# Altium project LeVentilateur.PrjPcb (part 3 of 4)

## Sheet 03-Actuators.SchDoc
size A4
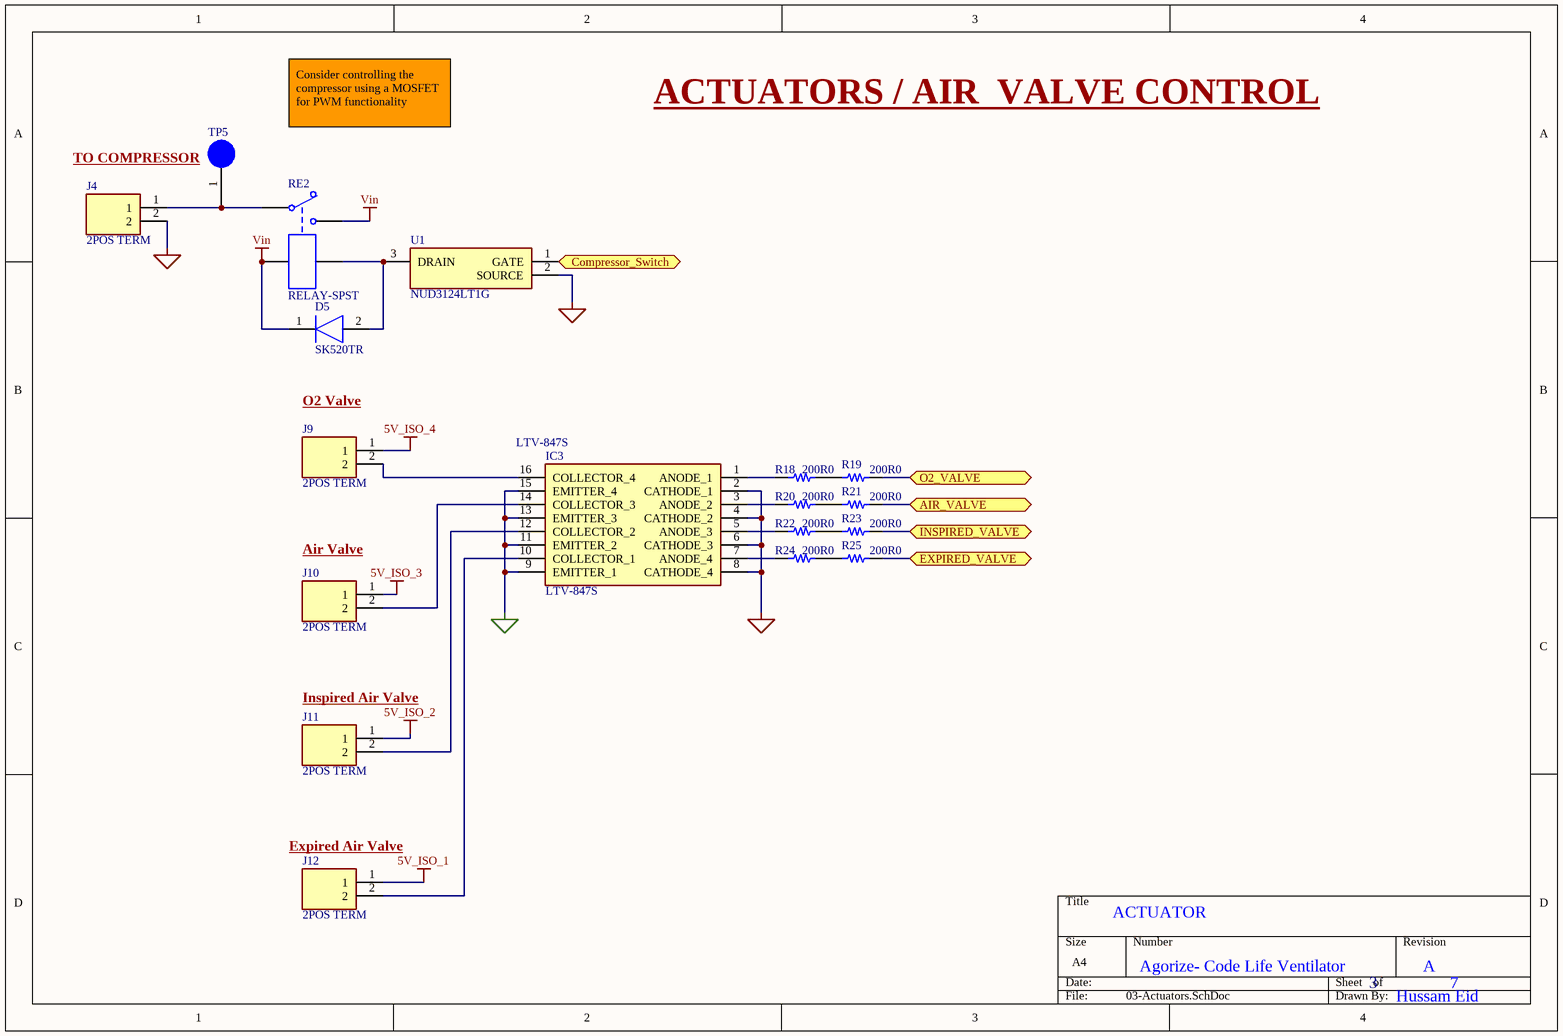
[diagram p2: 03-Actuators.SchDoc]

### Parts
D5  SK520TR  [DIOM8060X295N]
IC3  LTV-847S  [SOP254P1031X450-16N]
J4  2POS TERM  [SHDR2W110P0X500_1X2_1000X830X1140P]
J9  2POS TERM  [SHDR2W110P0X500_1X2_1000X830X1140P]
J10  2POS TERM  [SHDR2W110P0X500_1X2_1000X830X1140P]
J11  2POS TERM  [SHDR2W110P0X500_1X2_1000X830X1140P]
J12  2POS TERM  [SHDR2W110P0X500_1X2_1000X830X1140P]
R18  200R0  [RES 1206/3216]
R19  200R0  [RES 1206/3216]
R20  200R0  [RES 1206/3216]
R21  200R0  [RES 1206/3216]
R22  200R0  [RES 1206/3216]
R23  200R0  [RES 1206/3216]
R24  200R0  [RES 1206/3216]
R25  200R0  [RES 1206/3216]
RE2  RELAY-SPST  [JSM1A12V4]
TP5  TP  [TP]  (value not drawn)
U1  NUD3124LT1G  [SOT96P237X111-3N]

### Ports
AIR_VALVE (bidir), Compressor_Switch (bidir), EXPIRED_VALVE (bidir), INSPIRED_VALVE (bidir), O2_VALVE (bidir)

### Nets
5V_ISO_1: J12.1
5V_ISO_2: J11.1
5V_ISO_3: J10.1
5V_ISO_4: J9.1
COM: IC3.2(CATHODE_1) IC3.4(CATHODE_2) IC3.6(CATHODE_3) IC3.8(CATHODE_4) J4.2 U1.2(SOURCE)
COM_ISO: IC3.9(EMITTER_1) IC3.11(EMITTER_2) IC3.13(EMITTER_3) IC3.15(EMITTER_4)
Vin: D5.1(K) RE2.2 RE2.3
NetD5_2: D5.2(A) RE2.5 U1.3(DRAIN)
NetIC1_55: U1.1(GATE) ; port Compressor_Switch
NetIC1_56: R25.1 ; port EXPIRED_VALVE
NetIC1_57: R23.1 ; port INSPIRED_VALVE
NetIC1_58: R21.1 ; port AIR_VALVE
NetIC1_59: R19.1 ; port O2_VALVE
NetIC3_1: IC3.1(ANODE_1) R18.2
NetIC3_3: IC3.3(ANODE_2) R20.2
NetIC3_5: IC3.5(ANODE_3) R22.2
NetIC3_7: IC3.7(ANODE_4) R24.2
NetIC3_10: IC3.10(COLLECTOR_1) J12.2
NetIC3_12: IC3.12(COLLECTOR_2) J11.2
NetIC3_14: IC3.14(COLLECTOR_3) J10.2
NetIC3_16: IC3.16(COLLECTOR_4) J9.2
NetJ4_1: J4.1 RE2.1 TP5.1
NetR18_1: R18.1 R19.2
NetR20_1: R20.1 R21.2
NetR22_1: R22.1 R23.2
NetR24_1: R24.1 R25.2

### Notes on the sheet
- ACTUATORS / AIR  VALVE CONTROL
- TO COMPRESSOR
- Consider controlling the compressor using a MOSFET for PWM functionality
- O2 Valve
- (near J10) Air Valve
- (near J11) Inspired Air Valve
- (near J12) Expired Air Valve
- ACTUATOR
- Agorize- Code Life Ventilator
- 3
- A
- 7
- Hussam Eid

### Library data of the parts
D5 = SK520TR: DIODE SCHOTTKY 200V 5A SMC; Supplier 1: Digi-Key; Supplier Part Number 1: 1655-1603-1-ND; Manufacturer 1: SMC; Manufacturer Part Number 1: SK520TR; RoHS 1: No; Description 1: DIODE SCHOTTKY 200V 5A SMC; Stock 1: 19874; Pricing 1: 1 = 0.35000, 10 = 0.28500, 25 = 0.26040, 100 = 0.16360, 250 = 0.16176, 500 = 0.15148, 1000 = 0.10300 (USD); Mount: Surface Mount; Case/Package: SMC; Packaging: Tape and Reel; Max Reverse Voltage (DC): 200V; Average Rectified Current: 5A; ComponentLink1URL: http://www.smc-diodes.com/propdf/SK520%20N0107%20REV.A.pdf?src-supplier=Digi-Key; ComponentLink1Description: http://www.smc-diodes.com/propdf/SK520%20N0107%20REV.A.pdf?src-supplier=Digi-Key
IC3 = LTV-847S: OPTOISOLTR 5KV 4CH TRANS 16-SMD; Manufacturer 1: Vishay Lite-On; Forward Voltage: 1.4V; Rise Time: 18000ns; Number of Channels: 4; Collector Emitter Voltage (VCEO): 35V; Forward Current: 50mA; Collector Emitter Saturation Voltage: 200mV; Max Power Dissipation: 200mW; Current Transfer Ratio: 600%; Reverse Breakdown Voltage: 6V; Supplier 1: Digi-Key; Supplier Part Number 1: 160-1371-5-ND; Manufacturer Part Number 1: LTV-847S; RoHS 1: Yes; Description 1: OPTOISOLTR 5KV 4CH TRANS 16-SMD; Stock 1: 44348; Pricing 1: 1 = 1.02000, 10 = 0.82500, 100 = 0.50760, 500 = 0.43146, 1000 = 0.35532, 2500 = 0.33756, 5000 = 0.32994, 10000 = 0.32233, 25000 = 0.31725 (USD); Mount: Surface Mount; Case/Package: SMD/SMT; Number of Pins: 16; Min Operating Temperature: -30°C; Max Operating Temperature: 110°C; Packaging: Rail/Tube; Fall Time: 18000ns; Max Output Voltage: 35V; Output Current per Channel: 50mA; Max Input Current: 50mA; Isolation Voltage: 5kV; Max Collector Current: 50mA; Number of Elements: 4; Power Dissipation: 200mW; Package Quantity: 25; Number of Circuits: 4; Output Voltage: 35V; Radiation Hardening: No; Lead Free: Lead Free; ComponentLink1URL: https://datasheet.ciiva.com/11771/0900766b80de6da2-11771782.pdf?src-supplier=RSComponents; ComponentLink1Description: https://datasheet.ciiva.com/11771/0900766b80de6da2-11771782.pdf?src-supplier=RSComponents; ComponentLink2URL: https://datasheet.ciiva.com/15118/getdatasheetpartid-119507-15118694.pdf?src-supplier=Verical; ComponentLink2Description: https://datasheet.ciiva.com/15118/getdatasheetpartid-119507-15118694.pdf?src-supplier=Verical; ComponentLink3URL: https://datasheet.ciiva.com/2086/s-110-ltv-817827847m-s-s-ta-s-ta1-s-tpseries-2086410.pdf?src-supplier=Digi-Key; ComponentLink3Description: https://datasheet.ciiva.com/2086/s-110-ltv-817827847m-s-s-ta-s-ta1-s-tpseries-2086410.pdf?src-supplier=Digi-Key; ComponentLink4URL: https://datasheet.ciiva.com/16294/ltv-817-827-847-16294014.pdf?src-supplier=Future+Electronics; ComponentLink4Description: https://datasheet.ciiva.com/16294/ltv-817-827-847-16294014.pdf?src-supplier=Future+Electronics
J4 J9-J12 = 1935161: TERM BLK 2POS SIDE ENTRY 5MM PCB; Manufacturer 1: Phoenix Contact; Description 1: Conn Terminal Blocks 2 POS 5mm Solder ST Thru-Hole 16A; Connector Type: Screw; Voltage Rating (DC): 320V; Max Current Rating: 16A; Max Supply Voltage: 250V; Current Rating: 17.5A; Number of Poles: 2; Number of Levels: 1; Current: 18A; Voltage: 300V; Wire Gauge (Max): 26AWG; Wire Gauge (Min): 12AWG; Approvals: UL; ComponentLink1URL: https://datasheet.ciiva.com/15169/getdatasheetpartid-177903-15169663.pdf?src-supplier=Verical; ComponentLink1Description: https://datasheet.ciiva.com/15169/getdatasheetpartid-177903-15169663.pdf?src-supplier=Verical; ComponentLink2URL: https://datasheet.ciiva.com/16047/1935161-16047247.pdf?src-supplier=Onlinecomponents.com; ComponentLink2Description: https://datasheet.ciiva.com/16047/1935161-16047247.pdf?src-supplier=Onlinecomponents.com; ComponentLink3URL: https://datasheet.ciiva.com/824/combiconcompact5-0mmseries-824222.pdf?src-supplier=Digi-Key; ComponentLink3Description: https://datasheet.ciiva.com/824/combiconcompact5-0mmseries-824222.pdf?src-supplier=Digi-Key; Supplier 1: Digi-Key; Supplier Part Number 1: 277-1667-ND; Manufacturer Part Number 1: 1935161; RoHS 1: Yes; Stock 1: 32563; Pricing 1: 1 = 0.43000, 10 = 0.41100, 50 = 0.39280, 100 = 0.38200, 250 = 0.35700, 500 = 0.32844, 1000 = 0.30350 (USD); Mount: Through Hole; Number of Pins: 2; Weight: 0.067021oz; Contact Material: Copper,Tin; Insulation Material: Nylon; Housing Material: Polyamide; Housing Color: Green; Color: Green; Material: Nylon; Number of Rows: 1; Voltage Rating: 250V; Package Quantity: 250; Packaging: Bulk; Number of Positions: 2; Number of Positions Per Level: 2; Termination: Solder; Number of Contacts: 2; Number of Circuits: 2; Orientation: Straight; Length: 9mm; Height: 11.3mm; Width: 14.9mm; Pitch: 5mm; Depth: 9mm; Wire/Cable Gauge: 26AWG; Radiation Hardening: No; Flammability Rating: UL94 V-0; Lead Free: Lead Free; REACH SVHC: Unknown
R18-R25 = ERJ-8ENF1002V: RES SMD 10K OHM 1% 1/4W 1206; Manufacturer 1: Yageo; Manufacturer Part Number 1: RC1206FR-07200RL; Description 1: Res Thick Film 1206 200 Ohm 1% 0.25W(1/4W) ±100ppm/C Molded SMD Paper T/R; Temperature Coefficient: 100ppm/°C; Resistance: 200R; Voltage Rating (DC): 200V; Power Rating: 250mW; ComponentLink1Description: Datasheet; ComponentLink1URL: http://industrial.panasonic.com/www-cgi/jvcr13pz.cgi?E+PZ+3+AOA0002+ERJ8ENF1002V+7+WW; ComponentLink2Description: Digi-Key listing; ComponentLink2URL: http://digikey.com/product-detail/en/ERJ-8ENF1002V/P10.0KFTR-ND/89059; Supplier 1: Digi-Key; Supplier Part Number 1: 311-200FRCT-ND; RoHS 1: Yes; Stock 1: 2870115; Pricing 1: 1 = 0.10000, 10 = 0.07100, 100 = 0.02910, 1000 = 0.01306, 2500 = 0.01134 (USD); Mount: Surface Mount; Case/Package: 1206; Weight: 0.000571oz; Case Code (Metric): 3216; Case Code (Imperial): 1206; Min Operating Temperature: -55°C; Max Operating Temperature: 155°C; Composition: Thick Film; Tolerance: 1%; Packaging: Tape and Reel; Termination: SMD/SMT; Military Standard: Not; Voltage Rating: 200V; Length: 3.1mm; Height: 0.55mm; Width: 1.6mm; Depth: 1.6mm; Lead Free: Lead Free; ComponentLink3URL: https://datasheet.ciiva.com/11808/0900766b80c6630a-11808603.pdf?src-supplier=RSComponents; ComponentLink3Description: https://datasheet.ciiva.com/11808/0900766b80c6630a-11808603.pdf?src-supplier=RSComponents
RE2 = RELAY-SPST: RELAY AUTOMOTIVE SPST 15A 12V; Manufacturer 1: Panasonic; Manufacturer Part Number 1: JSM1A-12V-5; Max Voltage Rating (DC): 16V; Power Consumption: 640mW; Coil Current: 53.3mA; Operate Time: 10ms; Coil Resistance: 225R; Coil Type: Non-Latching; Supplier 1: Digi-Key; Supplier Part Number 1: 255-2815-ND; RoHS 1: Yes; Description 1: RELAY AUTOMOTIVE SPST 15A 12V; Stock 1: 2893; Pricing 1: 1 = 1.75000, 10 = 1.64300, 25 = 1.46000, 50 = 1.38700, 100 = 1.31400, 250 = 1.16800, 500 = 1.09500, 1000 = 1.02200, 5000 = 0.98550 (USD); Mount: Through Hole; Number of Pins: 4; Weight: 12g; Contact Material: Silver,Cadmium; Min Operating Temperature: -40°C; Max Operating Temperature: 85°C; Max Current Rating: 15A; Package Quantity: 100; Packaging: Bulk; Contact Current Rating: 15A; Throw Configuration: SPST; Release Time: 10ms; Termination: PC Pin; Coil Power: 640mW; Relay Type: Automotive; Coil Voltage (DC): 12V; Lead Free: Lead Free; ComponentLink1URL: https://datasheet.ciiva.com/2408/ds-61211-en-jsm-pd-2408039.pdf?src-supplier=Digi-Key; ComponentLink1Description: https://datasheet.ciiva.com/2408/ds-61211-en-jsm-pd-2408039.pdf?src-supplier=Digi-Key
TP5 = TP: Test Point
U1 = NUD3124LT1G: IC PWR DRVR N-CHAN 1:1 SOT23-3; Manufacturer 1: ON Semiconductor; Description 1: Trans MOSFET N-CH 28V 0.15A 3-Pin SOT-23 T/R; Output Configuration: Low Side; Rise Time: 708ns; Max Supply Voltage: 28V; Number of Outputs: 1; Max Output Current: 150mA; Gate to Source Voltage (Vgs): 12V; Power Dissipation: 225mW; Interface: On/Off; Output Current: 200mA; On-State Resistance: 1.4R; Element Configuration: Single; Drain to Source Resistance: 800mR; Supplier 1: Digi-Key; Supplier Part Number 1: NUD3124LT1GOSCT-ND; Manufacturer Part Number 1: NUD3124LT1G; RoHS 1: Yes; Stock 1: 48744; Pricing 1: 1 = 0.40000, 10 = 0.34200, 25 = 0.31880, 100 = 0.23690, 250 = 0.20044, 500 = 0.19132, 1000 = 0.14121 (USD); Mount: Surface Mount; Case/Package: SOT-23; Number of Pins: 3; Contact Plating: Tin,Matte; Min Operating Temperature: -40°C; Max Operating Temperature: 125°C; Packaging: Tape and Reel; Package Quantity: 3000; Continuous Drain Current (ID): 150mA; Number of Elements: 1; Number of Drivers: 1; Output Voltage: 28V; Current Rating: 200mA; Drain to Source Voltage (Vdss): 28V; Drain to Source Breakdown Voltage: 28V; Fall Time: 708ns; Length: 3.04mm; Height: 1.01mm; Width: 1.4mm; Radiation Hardening: No; Lead Free: Lead Free; Halogen Free: Halogen Free; REACH SVHC: No SVHC; ComponentLink1URL: https://datasheet.ciiva.com/1955/nud3124-d-1955016.pdf?src-supplier=Digi-Key; ComponentLink1Description: https://datasheet.ciiva.com/1955/nud3124-d-1955016.pdf?src-supplier=Digi-Key; ComponentLink2URL: https://datasheet.ciiva.com/11168/nud3124-d-11168232.pdf?src-supplier=Avnet; ComponentLink2Description: https://datasheet.ciiva.com/11168/nud3124-d-11168232.pdf?src-supplier=Avnet; ComponentLink3URL: https://datasheet.ciiva.com/1955/nud3124-d-1955017.pdf?src-supplier=Digi-Key; ComponentLink3Description: https://datasheet.ciiva.com/1955/nud3124-d-1955017.pdf?src-supplier=Digi-Key; ComponentLink4URL: https://datasheet.ciiva.com/16486/nud3124-d-16486430.pdf?src-supplier=Avnet+Asia; ComponentLink4Description: https://datasheet.ciiva.com/16486/nud3124-d-16486430.pdf?src-supplier=Avnet+Asia; ComponentLink5URL: https://datasheet.ciiva.com/1955/nud3124-d-1955015.pdf?src-supplier=Digi-Key; ComponentLink5Description: https://datasheet.ciiva.com/1955/nud3124-d-1955015.pdf?src-supplier=Digi-Key; ComponentLink6URL: https://datasheet.ciiva.com/1609/1792914-1609179.pdf?src-supplier=Newark; ComponentLink6Description: https://datasheet.ciiva.com/1609/1792914-1609179.pdf?src-supplier=Newark; ComponentLink7URL: https://datasheet.ciiva.com/26145/nud3124-d-26145435.pdf?src-supplier=Avnet+Europe; ComponentLink7Description: https://datasheet.ciiva.com/26145/nud3124-d-26145435.pdf?src-supplier=Avnet+Europe; ComponentLink8URL: https://datasheet.ciiva.com/11166/nud3124-d-11166028.pdf?src-supplier=Avnet; ComponentLink8Description: https://datasheet.ciiva.com/11166/nud3124-d-11166028.pdf?src-supplier=Avnet; ComponentLink9URL: https://datasheet.ciiva.com/16200/nud3124-d-16200989.pdf?src-supplier=Future+Electronics; ComponentLink9Description: https://datasheet.ciiva.com/16200/nud3124-d-16200989.pdf?src-supplier=Future+Electronics

## Sheet 04-Sensors.SchDoc
size A4
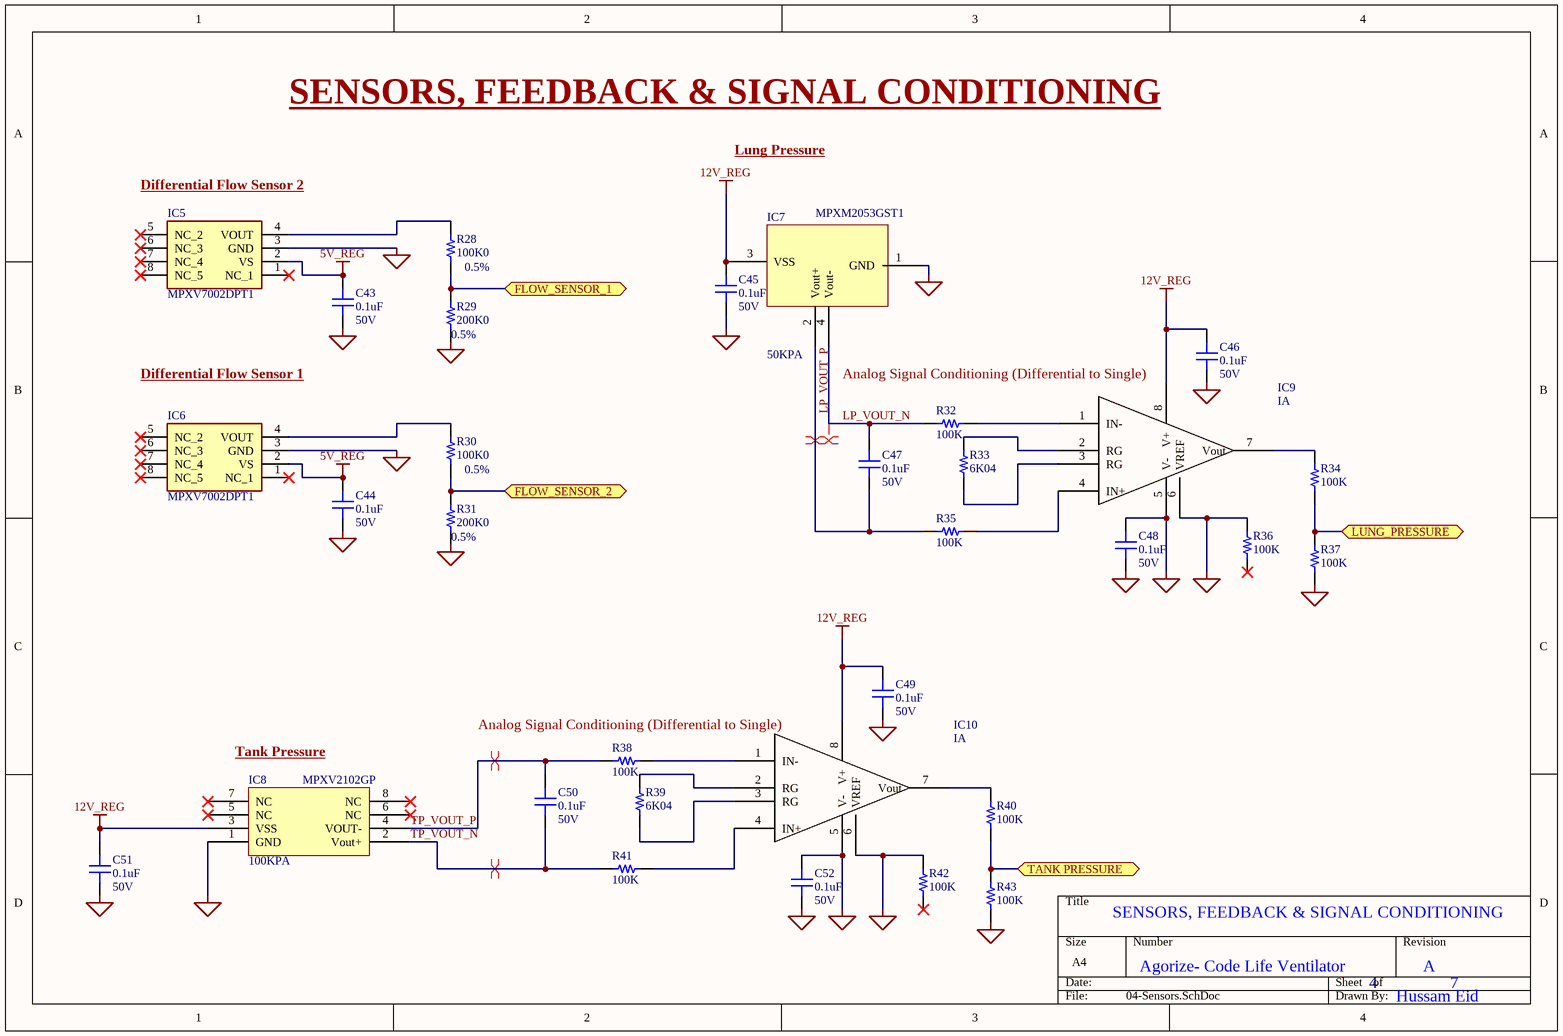
[diagram p3: 04-Sensors.SchDoc]

### Parts
C43  0.1uF  Voltage Rating: 50V  [CAP 0603/1608]
C44  0.1uF  Voltage Rating: 50V  [CAP 0603/1608]
C45  0.1uF  Voltage Rating: 50V  [CAP 0603/1608]
C46  0.1uF  Voltage Rating: 50V  [CAP 0603/1608]
C47  0.1uF  Voltage Rating: 50V  [CAP 0603/1608]
C48  0.1uF  Voltage Rating: 50V  [CAP 0603/1608]
C49  0.1uF  Voltage Rating: 50V  [CAP 0603/1608]
C50  0.1uF  Voltage Rating: 50V  [CAP 0603/1608]
C51  0.1uF  Voltage Rating: 50V  [CAP 0603/1608]
C52  0.1uF  Voltage Rating: 50V  [CAP 0603/1608]
IC5  MPXV7002DPT1  [MPXV7002DPT1]
IC6  MPXV7002DPT1  [MPXV7002DPT1]
IC7  50KPA  Manufacturer Part Number 1: MPXM2053GST1  [DPAK127P1219X1008-5N]
IC8  100KPA  Manufacturer Part Number 1: MPXV2102GP  [SOP127P600-8N]
IC9  IA  [SOP65P490X110-8N]
IC10  IA  [SOP65P490X110-8N]
R28  100K0  Tolerance: 0.5%  [RES 0603/1608]
R29  200K0  Tolerance: 0.5%  [RES 0603/1608]
R30  100K0  Tolerance: 0.5%  [RES 0603/1608]
R31  200K0  Tolerance: 0.5%  [RES 0603/1608]
R32  100K  [RES 0603/1608]
R33  6K04  [RES 0603/1608]
R34  100K  [RES 0603/1608]
R35  100K  [RES 0603/1608]
R36  100K  [RES 0603/1608]
R37  100K  [RES 0603/1608]
R38  100K  [RES 0603/1608]
R39  6K04  [RES 0603/1608]
R40  100K  [RES 0603/1608]
R41  100K  [RES 0603/1608]
R42  100K  [RES 0603/1608]
R43  100K  [RES 0603/1608]

### Ports
FLOW_SENSOR_1 (bidir), FLOW_SENSOR_2 (bidir), LUNG_PRESSURE (bidir), TANK PRESSURE (bidir)

### Nets
5V_REG: C43.1 C44.1 IC5.2(VS) IC6.2(VS)
12V_REG: C45.1 C46.2 C49.2 C51.2 IC7.3(VSS) IC8.3(VSS) IC9.8(V+) IC10.8(V+)
COM: C43.2 C44.2 C45.2 C46.1 C48.1 C48.2 C49.1 C51.1 C52.1 C52.2 IC5.3(GND) IC6.3(GND) IC7.1(GND) IC8.1(GND) IC9.5(V-) IC9.6(VREF) IC10.5(V-) IC10.6(VREF) R29.1 R31.1 R36.1 R37.2 R42.1 R43.2
LP_VOUT_N: C47.2 IC7.4(Vout-) R32.2
LP_VOUT_P: C47.1 IC7.2(Vout+) R35.2
TP_VOUT_N: C50.1 IC8.2(Vout+) R41.2
TP_VOUT_P: C50.2 IC8.4(VOUT-) R38.2
NetIC1_29: R34.2 R37.1 ; port LUNG_PRESSURE
NetIC1_30: R40.2 R43.1 ; port TANK PRESSURE
NetIC1_31: R30.1 R31.2 ; port FLOW_SENSOR_2
NetIC1_32: R28.1 R29.2 ; port FLOW_SENSOR_1
NetIC5_4: IC5.4(VOUT) R28.2
NetIC6_4: IC6.4(VOUT) R30.2
NetIC9_1: IC9.1(IN-) R32.1
NetIC9_2: IC9.2(RG) R33.2
NetIC9_3: IC9.3(RG) R33.1
NetIC9_4: IC9.4(IN+) R35.1
NetIC9_7: IC9.7(Vout) R34.1
NetIC10_1: IC10.1(IN-) R38.1
NetIC10_2: IC10.2(RG) R39.2
NetIC10_3: IC10.3(RG) R39.1
NetIC10_4: IC10.4(IN+) R41.1
NetIC10_7: IC10.7(Vout) R40.1

Not connected (* = marked no-connect by the designer): IC5 1(NC_1)* 5(NC_2)* 6(NC_3)* 7(NC_4)* 8(NC_5)*; IC6 1(NC_1)* 5(NC_2)* 6(NC_3)* 7(NC_4)* 8(NC_5)*; IC8 5(NC)* 6(NC)* 7(NC)* 8(NC)*; R36 2*; R42 2*

### Layout directives
differential pair: LP_VOUT_N, LP_VOUT_P, TP_VOUT_N, TP_VOUT_P

### Notes on the sheet
- SENSORS, FEEDBACK & SIGNAL CONDITIONING
- Lung Pressure
- (near IC5) Differential Flow Sensor 2
- Differential Flow Sensor 1
- (near C46) Analog Signal Conditioning (Differential to Single)
- (near IC8) Tank Pressure
- Analog Signal Conditioning (Differential to Single)
- Agorize- Code Life Ventilator
- 4
- A
- 7
- Hussam Eid

### Library data of the parts
C43-C52 = C1608X7R1E104K080AA: CAP CER 0.1UF 50V X7R 0603; Manufacturer 1: KEMET; Manufacturer Part Number 1: C0603C104M5RACTU; Description 1: Cap Ceramic 0.1uF 50V X7R 20% SMD 0603 125C T/R; Dielectric Material: Ceramic; Capacitance: 100nF; Tolerance: 20%; Dissipation Factor: 2.5%; ComponentLink1Description: Datasheet; ComponentLink1URL: https://product.tdk.com/info/en/catalog/datasheets/mlcc_commercial_general_en.pdf; ComponentLink2Description: Digi-Key listing; ComponentLink2URL: http://digikey.com/product-detail/en/C1608X7R1E104K080AA/445-1316-1-ND/567697; Supplier 1: Digi-Key; Supplier Part Number 1: 399-7845-1-ND; RoHS 1: Yes; Stock 1: 3475152; Pricing 1: 1 = 0.10000, 10 = 0.03900, 100 = 0.01740, 500 = 0.01240, 1000 = 0.00974 (USD); Mount: Surface Mount,PCB; Case/Package: 0603; Contact Plating: Tin,Matte; Case Code (Metric): 1608; Case Code (Imperial): 0603; Min Operating Temperature: -55°C; Max Operating Temperature: 125°C; Dielectric: X7R; Termination: SMD/SMT; Package Quantity: 1; Packaging: Tape and Reel; Voltage Rating (DC): 50V; Length: 1.6mm; Height: 0.8mm; Thickness: 0.034inch; Lead Pitch: 0.7mm; Depth: 0.8mm; Width: 0.031inch; Radiation Hardening: No; REACH SVHC: No SVHC; ComponentLink3URL: https://www.verical.com/server-webapp/html/getDatasheet?partID=626892&src-supplier=Verical; ComponentLink3Description: https://www.verical.com/server-webapp/html/getDatasheet?partID=626892&src-supplier=Verical; ComponentLink4URL: http://www.farnell.com/datasheets/2746056.pdf?src-supplier=Farnell; ComponentLink4Description: http://www.farnell.com/datasheets/2746056.pdf?src-supplier=Farnell; ComponentLink5URL: http://components.arrow.com/part/dataview/0323_00313986?src-supplier=Arrow+Europe; ComponentLink5Description: http://components.arrow.com/part/dataview/0323_00313986?src-supplier=Arrow+Europe; ComponentLink6URL: http://www.mouser.com/ds/2/212/KEM_C1002_X7R_SMD-1102033.pdf?src-supplier=Mouser; ComponentLink6Description: http://www.mouser.com/ds/2/212/KEM_C1002_X7R_SMD-1102033.pdf?src-supplier=Mouser; ComponentLink7URL: http://www.alliedelec.com/m/d/6f3b5eb83d09db50ed28bdc730567b33.pdf?src-supplier=Allied+Electronics; ComponentLink7Description: http://www.alliedelec.com/m/d/6f3b5eb83d09db50ed28bdc730567b33.pdf?src-supplier=Allied+Electronics; ComponentLink8URL: http://components.arrow.com/part/dataview/40911037S8853915N7429?src-supplier=Arrow; ComponentLink8Description: http://components.arrow.com/part/dataview/40911037S8853915N7429?src-supplier=Arrow; ComponentLink9URL: http://www.farnell.com/datasheets/2746056.pdf?src-supplier=Newark; ComponentLink9Description: http://www.farnell.com/datasheets/2746056.pdf?src-supplier=Newark; ComponentLink10URL: http://www.farnell.com/datasheets/1828800.pdf?src-supplier=Newark; ComponentLink10Description: http://www.farnell.com/datasheets/1828800.pdf?src-supplier=Newark; ComponentLink11URL: http://capacitoredge.kemet.com/capedge2/DataSheet?pn=C0603C104M5RAC7867&src-supplier=Avnet+Asia; ComponentLink11Description: http://capacitoredge.kemet.com/capedge2/DataSheet?pn=C0603C104M5RAC7867&src-supplier=Avnet+Asia; ComponentLink12URL: https://api.kemet.com/component-edge/download/datasheet/C0603C104M5RACTU.pdf?src-supplier=Digi-Key; ComponentLink12Description: https://api.kemet.com/component-edge/download/datasheet/C0603C104M5RACTU.pdf?src-supplier=Digi-Key; ComponentLink13URL: https://www.verical.com/server-webapp/html/getDatasheet?partID=110138&src-supplier=Verical; ComponentLink13Description: https://www.verical.com/server-webapp/html/getDatasheet?partID=110138&src-supplier=Verical; ComponentLink14URL: http://capacitoredge.kemet.com/capedge2/DataSheet?pn=C0603C104M5RAC7867&src-supplier=Avnet; ComponentLink14Description: http://capacitoredge.kemet.com/capedge2/DataSheet?pn=C0603C104M5RAC7867&src-supplier=Avnet; ComponentLink15URL: http://www.farnell.com/datasheets/2315113.pdf?src-supplier=Newark; ComponentLink15Description: http://www.farnell.com/datasheets/2315113.pdf?src-supplier=Newark; ComponentLink16URL: http://www.farnell.com/datasheets/2746056.pdf?src-supplier=Element14; ComponentLink16Description: http://www.farnell.com/datasheets/2746056.pdf?src-supplier=Element14
IC5 IC6 = MPXV7002DPT1: PRESSURE SENSOR DUAL PORT 8SOP; Manufacturer_Name: NXP; Manufacturer 1: NXP USA Inc.; Datasheet Link: http://www.nxp.com/docs/en/data-sheet/MPXV7002.pdf; Height: 9.906mm; Manufacturer_Part_Number: MPXV7002DPT1; Mouser Part Number: 841-MPXV7002DPT1; Mouser Price/Stock: https://www.mouser.com/Search/Refine.aspx?Keyword=841-MPXV7002DPT1; Manufacturer Part Number 1: MPXV7002DPT1
IC7 = Pressure Sensor: SENS PRESSURE 7.25 PSI MAX MPAK; Manufacturer 1: NXP Freescale; Description 1: Pressure Sensor 0V to 0.04V 0kPa to 50kPa Absolute Automotive 5-Pin(4+Tab) M-PAC T/R; Output Type: Wheatstone Bridge; Pressure Type: Vented Gauge; Operating Supply Voltage: 10V; Max Supply Voltage: 16V; Nominal Supply Current: 6mA; Output Voltage: 40mV; Accuracy: 0.4%; Port Style: Barbless; Max Pressure: 29.01PSI; Supplier 1: Digi-Key; Supplier Part Number 1: 568-13748-1-ND; RoHS 1: Yes; Stock 1: 1331; Pricing 1: 1 = 11.78000, 5 = 10.33200, 10 = 9.29900, 25 = 8.26600, 50 = 7.64600, 100 = 6.61270 (USD); Mount: Surface Mount; Case/Package: SMD/SMT; Weight: 0.018618oz; Min Operating Temperature: -40°C; Max Operating Temperature: 125°C; Packaging: Tape and Reel; Package Quantity: 400; Operating Pressure: 7.25PSI; Termination: PCB; Lead Free: Lead Free; Halogen Free: Halogen Free; ComponentLink1URL: https://datasheet.ciiva.com/3272/mpx2053-3272653.pdf?src-supplier=Avnet; ComponentLink1Description: https://datasheet.ciiva.com/3272/mpx2053-3272653.pdf?src-supplier=Avnet; ComponentLink2URL: https://datasheet.ciiva.com/2843/mpx2053-2843368.pdf?src-supplier=Digi-Key; ComponentLink2Description: https://datasheet.ciiva.com/2843/mpx2053-2843368.pdf?src-supplier=Digi-Key; ComponentLink3URL: https://datasheet.ciiva.com/16463/mpx2053-16463915.pdf?src-supplier=Future+Electronics; ComponentLink3Description: https://datasheet.ciiva.com/16463/mpx2053-16463915.pdf?src-supplier=Future+Electronics
IC8 = 100KPA Pressure Sensor: SENSOR GAUGE PRESS 14.5PSI MAX; Manufacturer 1: NXP Freescale; Description 1: Pressure Sensor 14.5 PSI (100 kPa) Vented Gauge Male - 0.13" (3.17mm) Tube 0 mV ~ 40 mV (10V) 8-SMD Module; Operating Supply Voltage: 10V; Max Supply Voltage: 16V; Nominal Supply Current: 6mA; Port Style: Barbed; Max Pressure: 58.02PSI; Accuracy: 0.5%; Output Voltage: 40mV; Output Type: Wheatstone Bridge; Pressure Type: Vented Gauge; Supplier 1: Digi-Key; Supplier Part Number 1: MPXV2102GP-ND; RoHS 1: Yes; Stock 1: 406; Pricing 1: 1 = 13.86000, 5 = 13.57400, 10 = 11.31200, 25 = 10.46360, 50 = 10.18080, 100 = 8.76680, 500 = 8.20120, 1000 = 7.77700, 5000 = 7.21140 (USD); Mount: Surface Mount; Case/Package: SOP; Number of Pins: 8; Weight: 0.061909oz; Min Operating Temperature: -40°C; Max Operating Temperature: 125°C; Packaging: Tray; Package Quantity: 125; Operating Pressure: 14.5PSI; Termination: PCB; Voltage Rating (DC): 10V; Lead Free: Lead Free; Halogen Free: Halogen Free; ComponentLink1URL: https://datasheet.ciiva.com/3272/mpx2102-3272661.pdf?src-supplier=Avnet; ComponentLink1Description: https://datasheet.ciiva.com/3272/mpx2102-3272661.pdf?src-supplier=Avnet; ComponentLink2URL: https://datasheet.ciiva.com/26022/mpx2102-26022587.pdf?src-supplier=Avnet+Europe; ComponentLink2Description: https://datasheet.ciiva.com/26022/mpx2102-26022587.pdf?src-supplier=Avnet+Europe; ComponentLink3URL: https://datasheet.ciiva.com/2843/mpx2102-2843513.pdf?src-supplier=Digi-Key; ComponentLink3Description: https://datasheet.ciiva.com/2843/mpx2102-2843513.pdf?src-supplier=Digi-Key
IC9 IC10 = IA: IC INST AMP 1 CIRCUIT 8VSSOP; Manufacturer 1: Texas Instruments; Manufacturer Part Number 1: INA826AIDGKR; Description 1: TEXAS INSTRUMENTS - INA826AIDGKR - ?????, 1????, 40 µV, 1 V/µs, 1 MHz, 2.7V ? 36V, ± 1.35V ? ± 18V, VSSOP; Common Mode Rejection Ratio: 84dB; Number of Channels: 1; Max Supply Voltage: 36V; Min Supply Voltage: 2.7V; Quiescent Current: 200uA; Input Bias Current: 65nA; Input Offset Voltage (Vos): 150uV; Input Voltage Noise Density: 18nV/sqrt Hz; Output Current per Channel: 16mA; Power Supply Rejection Ratio (PSRR): 100dB; Voltage Gain: 60dB; Input Resistance: 100kR; Slew Rate: 1V/µs; -3db Bandwidth: 1MHz; Min Dual Supply Voltage: 1.35V; Max Dual Supply Voltage: 18V; Supplier 1: Digi-Key; Supplier Part Number 1: 296-29663-1-ND; RoHS 1: Yes; Stock 1: 17777; Pricing 1: 1 = 2.73000, 10 = 2.44900, 25 = 2.31000, 100 = 1.84800, 250 = 1.61700, 500 = 1.57080, 1000 = 1.24740 (USD); Case/Package: VSSOP; Number of Pins: 8; Weight: 0.000935oz; Contact Plating: Gold; Min Operating Temperature: -40°C; Max Operating Temperature: 125°C; Operating Supply Current: 200uA; Number of Circuits: 1; Number of Elements: 1; Number of Amplifiers: 1; Packaging: Tape and Reel; Bandwidth: 1MHz; Package Quantity: 2500; Radiation Hardening: No; REACH SVHC: No SVHC; Lead Free: Lead Free; ComponentLink1URL: https://datasheet.ciiva.com/1487/1806064-1487618.pdf?src-supplier=Element14; ComponentLink1Description: https://datasheet.ciiva.com/1487/1806064-1487618.pdf?src-supplier=Element14; ComponentLink2URL: https://datasheet.ciiva.com/1798/ina826-1798294.pdf?src-supplier=Digi-Key; ComponentLink2Description: https://datasheet.ciiva.com/1798/ina826-1798294.pdf?src-supplier=Digi-Key; ComponentLink3URL: https://datasheet.ciiva.com/1798/ina826-1798295.pdf?src-supplier=Digi-Key; ComponentLink3Description: https://datasheet.ciiva.com/1798/ina826-1798295.pdf?src-supplier=Digi-Key; ComponentLink4URL: https://datasheet.ciiva.com/1798/ina826-1798296.pdf?src-supplier=Digi-Key; ComponentLink4Description: https://datasheet.ciiva.com/1798/ina826-1798296.pdf?src-supplier=Digi-Key; ComponentLink5URL: https://datasheet.ciiva.com/14338/ina826-14338024.pdf?src-supplier=Avnet; ComponentLink5Description: https://datasheet.ciiva.com/14338/ina826-14338024.pdf?src-supplier=Avnet
R28 R30 = ERJ-3EKF1001V: RES SMD 100K OHM 0.5% 1/16W 0603; Manufacturer 1: Susumu; Manufacturer Part Number 1: RR0816P-104-D; Max Power Dissipation: 63mW; Voltage Rating (DC): 75V; Resistance: 100kR; Temperature Coefficient: 25ppm/°C; ComponentLink7URL: https://datasheet.ciiva.com/28695/1678796-28695833.pdf?src-supplier=Element14; ComponentLink7Description: https://datasheet.ciiva.com/28695/1678796-28695833.pdf?src-supplier=Element14; ComponentLink8URL: https://datasheet.ciiva.com/5959/1678796-5959707.pdf?src-supplier=Farnell; ComponentLink8Description: https://datasheet.ciiva.com/5959/1678796-5959707.pdf?src-supplier=Farnell; ComponentLink9URL: https://datasheet.ciiva.com/46377/1678796-46377868.pdf?src-supplier=Element14; ComponentLink9Description: https://datasheet.ciiva.com/46377/1678796-46377868.pdf?src-supplier=Element14; ComponentLink10URL: https://datasheet.ciiva.com/9198/aoa0000ce1-9198975.pdf?src-supplier=Avnet; ComponentLink10Description: https://datasheet.ciiva.com/9198/aoa0000ce1-9198975.pdf?src-supplier=Avnet; ComponentLink11URL: https://datasheet.ciiva.com/16758/70255313-16758527.pdf?src-supplier=Allied+Electronics; ComponentLink11Description: https://datasheet.ciiva.com/16758/70255313-16758527.pdf?src-supplier=Allied+Electronics; ComponentLink12URL: https://datasheet.ciiva.com/16834/aoa0000ce1-16834828.pdf?src-supplier=Future+Electronics; ComponentLink12Description: https://datasheet.ciiva.com/16834/aoa0000ce1-16834828.pdf?src-supplier=Future+Electronics; ComponentLink13URL: https://datasheet.ciiva.com/17215/aoa0000ce1-17215388.pdf?src-supplier=Avnet+Europe; ComponentLink13Description: https://datasheet.ciiva.com/17215/aoa0000ce1-17215388.pdf?src-supplier=Avnet+Europe; ComponentLink14URL: https://datasheet.ciiva.com/30199/4aoa0000ce1-30199822.pdf?src-supplier=Onlinecomponents.com; ComponentLink14Description: https://datasheet.ciiva.com/30199/4aoa0000ce1-30199822.pdf?src-supplier=Onlinecomponents.com; Supplier 1: Digi-Key; Supplier Part Number 1: RR08P100KDCT-ND; RoHS 1: Yes; Description 1: RES SMD 100K OHM 0.5% 1/16W 0603; Stock 1: 90889; Pricing 1: 1 = 0.10000, 10 = 0.09300, 100 = 0.03580, 1000 = 0.01575, 2500 = 0.01360 (USD); Case/Package: 0603; Number of Pins: 2; Case Code (Imperial): 0603; Case Code (Metric): 1608; Min Operating Temperature: -55°C; Max Operating Temperature: 125°C; Power Rating: 63mW; Voltage Rating: 75V; Packaging: Tape and Reel; Package Quantity: 1; Termination: SMD/SMT; Composition: Thin Film; Number of Terminations: 2; Working Voltage: 75V; Length: 1.6mm; Height: 0.4mm; Width: 0.8mm; Depth: 0.8mm; Lead Free: Lead Free; REACH SVHC: Unknown; ComponentLink1URL: https://datasheet.ciiva.com/11820/0900766b80808d64-11820638.pdf?src-supplier=RSComponents; ComponentLink1Description: https://datasheet.ciiva.com/11820/0900766b80808d64-11820638.pdf?src-supplier=RSComponents; ComponentLink2URL: https://datasheet.ciiva.com/7984/87330-7984341.pdf?src-supplier=Element14; ComponentLink2Description: https://datasheet.ciiva.com/7984/87330-7984341.pdf?src-supplier=Element14; ComponentLink3URL: https://datasheet.ciiva.com/2487/rr-data-sheet-2487067.pdf?src-supplier=Digi-Key; ComponentLink3Description: https://datasheet.ciiva.com/2487/rr-data-sheet-2487067.pdf?src-supplier=Digi-Key; ComponentLink4URL: https://datasheet.ciiva.com/2487/rr-data-sheet-2487068.pdf?src-supplier=Digi-Key; ComponentLink4Description: https://datasheet.ciiva.com/2487/rr-data-sheet-2487068.pdf?src-supplier=Digi-Key; ComponentLink5URL: https://datasheet.ciiva.com/2487/rr-data-sheet-2487069.pdf?src-supplier=Digi-Key; ComponentLink5Description: https://datasheet.ciiva.com/2487/rr-data-sheet-2487069.pdf?src-supplier=Digi-Key
R29 R31 = ERJ-3EKF1001V: RES SMD 200K OHM 0.5% 1/16W 0603; Manufacturer 1: Susumu; Manufacturer Part Number 1: RR0816P-204-D; Voltage Rating (DC): 75V; Resistance: 200kR; Power Rating: 63mW; Temperature Coefficient: 25ppm/°C; ComponentLink7URL: https://datasheet.ciiva.com/28695/1678796-28695833.pdf?src-supplier=Element14; ComponentLink7Description: https://datasheet.ciiva.com/28695/1678796-28695833.pdf?src-supplier=Element14; ComponentLink8URL: https://datasheet.ciiva.com/5959/1678796-5959707.pdf?src-supplier=Farnell; ComponentLink8Description: https://datasheet.ciiva.com/5959/1678796-5959707.pdf?src-supplier=Farnell; ComponentLink9URL: https://datasheet.ciiva.com/46377/1678796-46377868.pdf?src-supplier=Element14; ComponentLink9Description: https://datasheet.ciiva.com/46377/1678796-46377868.pdf?src-supplier=Element14; ComponentLink10URL: https://datasheet.ciiva.com/9198/aoa0000ce1-9198975.pdf?src-supplier=Avnet; ComponentLink10Description: https://datasheet.ciiva.com/9198/aoa0000ce1-9198975.pdf?src-supplier=Avnet; ComponentLink11URL: https://datasheet.ciiva.com/16758/70255313-16758527.pdf?src-supplier=Allied+Electronics; ComponentLink11Description: https://datasheet.ciiva.com/16758/70255313-16758527.pdf?src-supplier=Allied+Electronics; ComponentLink12URL: https://datasheet.ciiva.com/16834/aoa0000ce1-16834828.pdf?src-supplier=Future+Electronics; ComponentLink12Description: https://datasheet.ciiva.com/16834/aoa0000ce1-16834828.pdf?src-supplier=Future+Electronics; ComponentLink13URL: https://datasheet.ciiva.com/17215/aoa0000ce1-17215388.pdf?src-supplier=Avnet+Europe; ComponentLink13Description: https://datasheet.ciiva.com/17215/aoa0000ce1-17215388.pdf?src-supplier=Avnet+Europe; ComponentLink14URL: https://datasheet.ciiva.com/30199/4aoa0000ce1-30199822.pdf?src-supplier=Onlinecomponents.com; ComponentLink14Description: https://datasheet.ciiva.com/30199/4aoa0000ce1-30199822.pdf?src-supplier=Onlinecomponents.com; ComponentLink1URL: https://datasheet.ciiva.com/11820/0900766b80808d64-11820638.pdf?src-supplier=RSComponents; ComponentLink1Description: https://datasheet.ciiva.com/11820/0900766b80808d64-11820638.pdf?src-supplier=RSComponents; ComponentLink2URL: https://datasheet.ciiva.com/7984/87330-7984341.pdf?src-supplier=Element14; ComponentLink2Description: https://datasheet.ciiva.com/7984/87330-7984341.pdf?src-supplier=Element14; ComponentLink3URL: https://datasheet.ciiva.com/2487/rr-data-sheet-2487067.pdf?src-supplier=Digi-Key; ComponentLink3Description: https://datasheet.ciiva.com/2487/rr-data-sheet-2487067.pdf?src-supplier=Digi-Key; ComponentLink4URL: https://datasheet.ciiva.com/2487/rr-data-sheet-2487068.pdf?src-supplier=Digi-Key; ComponentLink4Description: https://datasheet.ciiva.com/2487/rr-data-sheet-2487068.pdf?src-supplier=Digi-Key; ComponentLink5URL: https://datasheet.ciiva.com/2487/rr-data-sheet-2487069.pdf?src-supplier=Digi-Key; ComponentLink5Description: https://datasheet.ciiva.com/2487/rr-data-sheet-2487069.pdf?src-supplier=Digi-Key; Supplier 1: Digi-Key; Supplier Part Number 1: RR08P200KDCT-ND; RoHS 1: Yes; Description 1: RES SMD 200K OHM 0.5% 1/16W 0603; Stock 1: 54417; Pricing 1: 1 = 0.11000, 10 = 0.09800, 100 = 0.03760, 1000 = 0.01654, 2500 = 0.01428 (USD); Case/Package: 0603; Number of Pins: 2; Case Code (Imperial): 0603; Case Code (Metric): 1608; Min Operating Temperature: -55°C; Max Operating Temperature: 125°C; Packaging: Tape and Reel; Voltage Rating: 75V; Termination: SMD/SMT; Composition: Thin Film; Working Voltage: 75V; Number of Terminations: 2; Length: 1.6mm; Height: 0.4mm; Width: 0.8mm; Depth: 0.8mm; Lead Free: Lead Free; REACH SVHC: Unknown; ComponentLink6URL: https://datasheet.ciiva.com/11820/0900766b80808d64-11820394.pdf?src-supplier=RSComponents; ComponentLink6Description: https://datasheet.ciiva.com/11820/0900766b80808d64-11820394.pdf?src-supplier=RSComponents; ComponentLink15URL: https://datasheet.ciiva.com/7984/87330-7984334.pdf?src-supplier=Element14; ComponentLink15Description: https://datasheet.ciiva.com/7984/87330-7984334.pdf?src-supplier=Element14
R32 R34-R38 R40-R43 = ERJ-3EKF1001V: RES SMD100K OHM 0.5% 1/16W 0603; Manufacturer 1: Susumu; Manufacturer Part Number 1: RR0816P-104-D; Max Power Dissipation: 63mW; Voltage Rating (DC): 75V; Resistance: 100kR; Temperature Coefficient: 25ppm/°C; ComponentLink7URL: https://datasheet.ciiva.com/28695/1678796-28695833.pdf?src-supplier=Element14; ComponentLink7Description: https://datasheet.ciiva.com/28695/1678796-28695833.pdf?src-supplier=Element14; ComponentLink8URL: https://datasheet.ciiva.com/5959/1678796-5959707.pdf?src-supplier=Farnell; ComponentLink8Description: https://datasheet.ciiva.com/5959/1678796-5959707.pdf?src-supplier=Farnell; ComponentLink9URL: https://datasheet.ciiva.com/46377/1678796-46377868.pdf?src-supplier=Element14; ComponentLink9Description: https://datasheet.ciiva.com/46377/1678796-46377868.pdf?src-supplier=Element14; ComponentLink10URL: https://datasheet.ciiva.com/9198/aoa0000ce1-9198975.pdf?src-supplier=Avnet; ComponentLink10Description: https://datasheet.ciiva.com/9198/aoa0000ce1-9198975.pdf?src-supplier=Avnet; ComponentLink11URL: https://datasheet.ciiva.com/16758/70255313-16758527.pdf?src-supplier=Allied+Electronics; ComponentLink11Description: https://datasheet.ciiva.com/16758/70255313-16758527.pdf?src-supplier=Allied+Electronics; ComponentLink12URL: https://datasheet.ciiva.com/16834/aoa0000ce1-16834828.pdf?src-supplier=Future+Electronics; ComponentLink12Description: https://datasheet.ciiva.com/16834/aoa0000ce1-16834828.pdf?src-supplier=Future+Electronics; ComponentLink13URL: https://datasheet.ciiva.com/17215/aoa0000ce1-17215388.pdf?src-supplier=Avnet+Europe; ComponentLink13Description: https://datasheet.ciiva.com/17215/aoa0000ce1-17215388.pdf?src-supplier=Avnet+Europe; ComponentLink14URL: https://datasheet.ciiva.com/30199/4aoa0000ce1-30199822.pdf?src-supplier=Onlinecomponents.com; ComponentLink14Description: https://datasheet.ciiva.com/30199/4aoa0000ce1-30199822.pdf?src-supplier=Onlinecomponents.com; ComponentLink1URL: https://datasheet.ciiva.com/11820/0900766b80808d64-11820638.pdf?src-supplier=RSComponents; ComponentLink1Description: https://datasheet.ciiva.com/11820/0900766b80808d64-11820638.pdf?src-supplier=RSComponents; ComponentLink2URL: https://datasheet.ciiva.com/7984/87330-7984341.pdf?src-supplier=Element14; ComponentLink2Description: https://datasheet.ciiva.com/7984/87330-7984341.pdf?src-supplier=Element14; ComponentLink3URL: https://datasheet.ciiva.com/2487/rr-data-sheet-2487067.pdf?src-supplier=Digi-Key; ComponentLink3Description: https://datasheet.ciiva.com/2487/rr-data-sheet-2487067.pdf?src-supplier=Digi-Key; ComponentLink4URL: https://datasheet.ciiva.com/2487/rr-data-sheet-2487068.pdf?src-supplier=Digi-Key; ComponentLink4Description: https://datasheet.ciiva.com/2487/rr-data-sheet-2487068.pdf?src-supplier=Digi-Key; ComponentLink5URL: https://datasheet.ciiva.com/2487/rr-data-sheet-2487069.pdf?src-supplier=Digi-Key; ComponentLink5Description: https://datasheet.ciiva.com/2487/rr-data-sheet-2487069.pdf?src-supplier=Digi-Key; ComponentLink6URL: https://datasheet.ciiva.com/11820/0900766b80808d64-11820394.pdf?src-supplier=RSComponents; ComponentLink6Description: https://datasheet.ciiva.com/11820/0900766b80808d64-11820394.pdf?src-supplier=RSComponents; ComponentLink15URL: https://datasheet.ciiva.com/7984/87330-7984334.pdf?src-supplier=Element14; ComponentLink15Description: https://datasheet.ciiva.com/7984/87330-7984334.pdf?src-supplier=Element14; Supplier 1: Digi-Key; Supplier Part Number 1: RR08P100KDCT-ND; RoHS 1: Yes; Description 1: RES SMD 100K OHM 0.5% 1/16W 0603; Stock 1: 90889; Pricing 1: 1 = 0.10000, 10 = 0.09300, 100 = 0.03580, 1000 = 0.01575, 2500 = 0.01360 (USD); Case/Package: 0603; Number of Pins: 2; Case Code (Imperial): 0603; Case Code (Metric): 1608; Min Operating Temperature: -55°C; Max Operating Temperature: 125°C; Tolerance: 0.5%; Power Rating: 63mW; Voltage Rating: 75V; Packaging: Tape and Reel; Package Quantity: 1; Termination: SMD/SMT; Composition: Thin Film; Number of Terminations: 2; Working Voltage: 75V; Length: 1.6mm; Height: 0.4mm; Width: 0.8mm; Depth: 0.8mm; Lead Free: Lead Free; REACH SVHC: Unknown
R33 R39 = ERJ-3EKF1001V: RES SMD 6K04 OHM 0.5% 1/16W 0603; Manufacturer 1: Stackpole Electronics; Manufacturer Part Number 1: RMCF0603FT6K04; Description 1: Res Thick Film 0603 6.04K Ohm 1% 1/10W 100ppm/C Molded SMD SMD Paper T/R; Resistance: 6.04kR; Tolerance: 1%; Power Rating: 100mW; Temperature Coefficient: 100ppm/°C; ComponentLink7URL: https://datasheet.ciiva.com/28695/1678796-28695833.pdf?src-supplier=Element14; ComponentLink7Description: https://datasheet.ciiva.com/28695/1678796-28695833.pdf?src-supplier=Element14; ComponentLink8URL: https://datasheet.ciiva.com/5959/1678796-5959707.pdf?src-supplier=Farnell; ComponentLink8Description: https://datasheet.ciiva.com/5959/1678796-5959707.pdf?src-supplier=Farnell; ComponentLink9URL: https://datasheet.ciiva.com/46377/1678796-46377868.pdf?src-supplier=Element14; ComponentLink9Description: https://datasheet.ciiva.com/46377/1678796-46377868.pdf?src-supplier=Element14; ComponentLink10URL: https://datasheet.ciiva.com/9198/aoa0000ce1-9198975.pdf?src-supplier=Avnet; ComponentLink10Description: https://datasheet.ciiva.com/9198/aoa0000ce1-9198975.pdf?src-supplier=Avnet; ComponentLink11URL: https://datasheet.ciiva.com/16758/70255313-16758527.pdf?src-supplier=Allied+Electronics; ComponentLink11Description: https://datasheet.ciiva.com/16758/70255313-16758527.pdf?src-supplier=Allied+Electronics; ComponentLink12URL: https://datasheet.ciiva.com/16834/aoa0000ce1-16834828.pdf?src-supplier=Future+Electronics; ComponentLink12Description: https://datasheet.ciiva.com/16834/aoa0000ce1-16834828.pdf?src-supplier=Future+Electronics; ComponentLink13URL: https://datasheet.ciiva.com/17215/aoa0000ce1-17215388.pdf?src-supplier=Avnet+Europe; ComponentLink13Description: https://datasheet.ciiva.com/17215/aoa0000ce1-17215388.pdf?src-supplier=Avnet+Europe; ComponentLink14URL: https://datasheet.ciiva.com/30199/4aoa0000ce1-30199822.pdf?src-supplier=Onlinecomponents.com; ComponentLink14Description: https://datasheet.ciiva.com/30199/4aoa0000ce1-30199822.pdf?src-supplier=Onlinecomponents.com; ComponentLink1URL: https://datasheet.ciiva.com/11820/0900766b80808d64-11820638.pdf?src-supplier=RSComponents; ComponentLink1Description: https://datasheet.ciiva.com/11820/0900766b80808d64-11820638.pdf?src-supplier=RSComponents; ComponentLink2URL: https://datasheet.ciiva.com/7984/87330-7984341.pdf?src-supplier=Element14; ComponentLink2Description: https://datasheet.ciiva.com/7984/87330-7984341.pdf?src-supplier=Element14; ComponentLink3URL: https://datasheet.ciiva.com/2487/rr-data-sheet-2487067.pdf?src-supplier=Digi-Key; ComponentLink3Description: https://datasheet.ciiva.com/2487/rr-data-sheet-2487067.pdf?src-supplier=Digi-Key; ComponentLink4URL: https://datasheet.ciiva.com/2487/rr-data-sheet-2487068.pdf?src-supplier=Digi-Key; ComponentLink4Description: https://datasheet.ciiva.com/2487/rr-data-sheet-2487068.pdf?src-supplier=Digi-Key; ComponentLink5URL: https://datasheet.ciiva.com/2487/rr-data-sheet-2487069.pdf?src-supplier=Digi-Key; ComponentLink5Description: https://datasheet.ciiva.com/2487/rr-data-sheet-2487069.pdf?src-supplier=Digi-Key; ComponentLink6URL: https://datasheet.ciiva.com/11820/0900766b80808d64-11820394.pdf?src-supplier=RSComponents; ComponentLink6Description: https://datasheet.ciiva.com/11820/0900766b80808d64-11820394.pdf?src-supplier=RSComponents; ComponentLink15URL: https://datasheet.ciiva.com/7984/87330-7984334.pdf?src-supplier=Element14; ComponentLink15Description: https://datasheet.ciiva.com/7984/87330-7984334.pdf?src-supplier=Element14; Supplier 1: Digi-Key; Supplier Part Number 1: RMCF0603FT6K04CT-ND; RoHS 1: Yes; Stock 1: 57211; Pricing 1: 1 = 0.10000, 10 = 0.01600, 100 = 0.00650, 1000 = 0.00292, 2500 = 0.00253 (USD); Mount: Surface Mount; Case/Package: 0603; Case Code (Imperial): 0603; Case Code (Metric): 1608; Contact Plating: Tin,Matte; Min Operating Temperature: -55°C; Max Operating Temperature: 155°C; Features: Automotive AEC-Q200; Packaging: Tape and Reel; Composition: Thick Film; Number of Terminations: 2; Max Power Dissipation: 100mW; Length: 0.061inch; Height: 0.022inch; Width: 0.031inch; Radiation Hardening: No; Lead Free: Lead Free; ComponentLink16URL: http://components.arrow.com/part/dataview/44987894S7815445N1174?src-supplier=Arrow; ComponentLink16Description: http://components.arrow.com/part/dataview/44987894S7815445N1174?src-supplier=Arrow; ComponentLink17URL: https://www.seielect.com/catalog/SEI-RMCF_RMCP.pdf?src-supplier=Avnet; ComponentLink17Description: https://www.seielect.com/catalog/SEI-RMCF_RMCP.pdf?src-supplier=Avnet; ComponentLink18URL: https://www.seielect.com/catalog/SEI-Packaging.pdf?src-supplier=Digi-Key; ComponentLink18Description: https://www.seielect.com/catalog/SEI-Packaging.pdf?src-supplier=Digi-Key; ComponentLink19URL: http://www.seielect.com/Catalog/SEI-RMC.pdf?src-supplier=Future+Electronics; ComponentLink19Description: http://www.seielect.com/Catalog/SEI-RMC.pdf?src-supplier=Future+Electronics; ComponentLink20URL: https://www.seielect.com/catalog/SEI-RMCF_RMCP.pdf?src-supplier=Avnet+Asia; ComponentLink20Description: https://www.seielect.com/catalog/SEI-RMCF_RMCP.pdf?src-supplier=Avnet+Asia